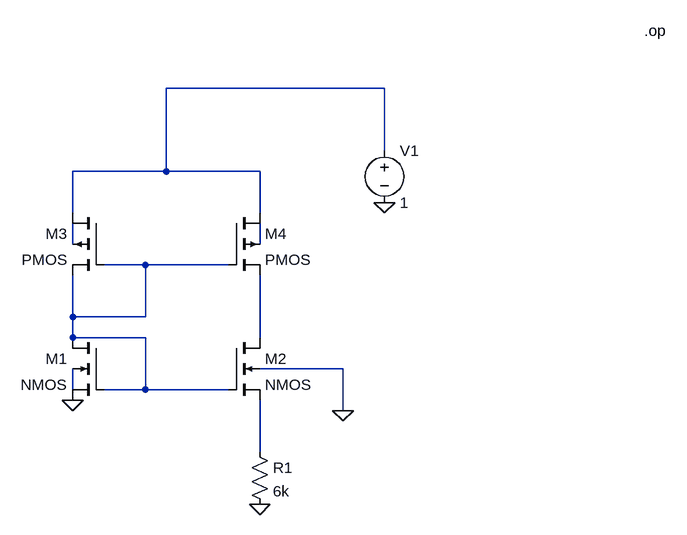
[diagram p0: schematic β-multiplier.asc]
β-multiplier.asc, the LTspice schematic file:
Version 4
SHEET 1 904 680
WIRE 464 -496 128 -496
WIRE 464 -400 464 -496
WIRE 128 -368 128 -496
WIRE 128 -368 -16 -368
WIRE 272 -368 128 -368
WIRE -16 -304 -16 -368
WIRE 272 -304 272 -368
WIRE -16 -256 -16 -288
WIRE 272 -256 272 -288
WIRE 96 -224 32 -224
WIRE 224 -224 96 -224
WIRE -16 -144 -16 -208
WIRE 96 -144 96 -224
WIRE 96 -144 -16 -144
WIRE -16 -112 -16 -144
WIRE 96 -112 -16 -112
WIRE 272 -112 272 -208
WIRE 400 -64 272 -64
WIRE -16 -32 -16 -64
WIRE 96 -32 96 -112
WIRE 96 -32 32 -32
WIRE 224 -32 96 -32
WIRE 400 0 400 -64
WIRE 272 64 272 -16
FLAG 464 -320 0
FLAG -16 -16 0
FLAG 272 144 0
FLAG 400 0 0
SYMBOL nmos4 32 -112 M0
SYMATTR InstName M1
SYMATTR Value2 l=100n w=1u
SYMBOL nmos4 224 -112 R0
SYMATTR InstName M2
SYMATTR Value2 l=100n w=4u
SYMBOL pmos4 32 -304 M0
SYMATTR InstName M3
SYMATTR Value2 l=100n w=2u
SYMBOL pmos4 224 -304 R0
SYMATTR InstName M4
SYMATTR Value2 l=100n w=2u
SYMBOL res 256 48 R0
SYMATTR InstName R1
SYMATTR Value 6k
SYMBOL voltage 464 -416 R0
WINDOW 123 0 0 Left 0
WINDOW 39 0 0 Left 0
SYMATTR InstName V1
SYMATTR Value 1
TEXT 864 -584 Left 2 !.op

The netlist it stands for:
* β-multiplier.asc
M1 N004 N004 0 N006 NMOS l=100n w=1u
M2 N005 N004 N007 0 NMOS l=100n w=4u
M3 N001 N004 N004 N002 PMOS l=100n w=2u
M4 N001 N004 N005 N003 PMOS l=100n w=2u
R1 N007 0 6k
V1 N001 0 1
.model NMOS NMOS
.model PMOS PMOS
.lib standard.mos
.op
.backanno
.end